# Altium schematic sheet Differential Encoder Receiver.SchDoc
size A4; SheetNumber: 5; SheetTotal: 6
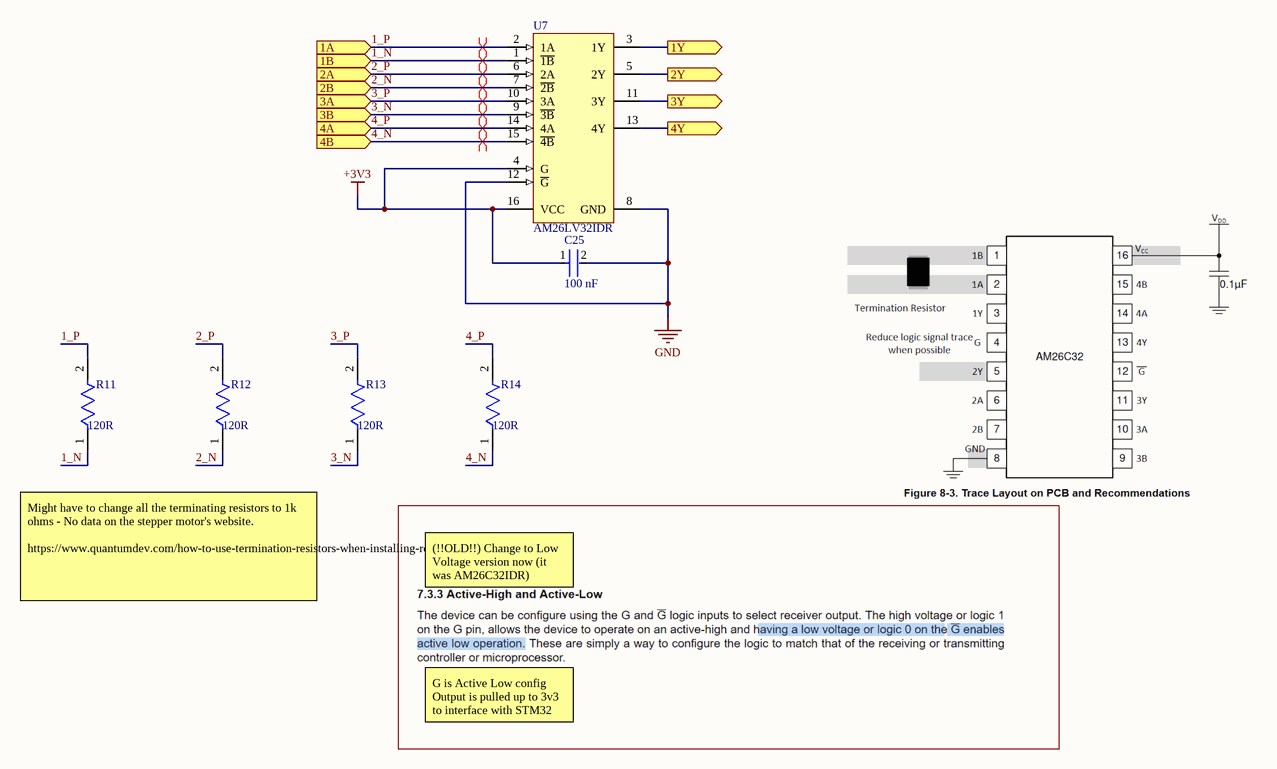
[diagram p0: Differential Encoder Receiver.SchDoc]

## Parts
C25  Capacitance: 100 nF  [FP-CC0603-DA-MFG]  (hidden comment: CC0603KRX7R9BB104)
R11  Resistance: 120R  [FP-CRCW0603-e3-MFG]  (hidden comment: 0603WAF1200T5E)
R12  Resistance: 120R  [FP-CRCW0603-e3-MFG]  (hidden comment: 0603WAF1200T5E)
R13  Resistance: 120R  [FP-CRCW0603-e3-MFG]  (hidden comment: 0603WAF1200T5E)
R14  Resistance: 120R  [FP-CRCW0603-e3-MFG]  (hidden comment: 0603WAF1200T5E)
U7  AM26LV32IDR  [D0016A_N]

## Ports
1A (in, see Actuation[2B]), 1B (in, see Actuation[2B]), 1Y (out, see Actuation[3B]), 2A (in, see Actuation[2B]), 2B (in, see Actuation[2B]), 2Y (out, see Actuation[3B]), 3A (in, see Actuation[2B]), 3B (in, see Actuation[2B]), 3Y (out, see Actuation[3B]), 4A (in, see Actuation[2B]), 4B (in, see Actuation[2B]), 4Y (out, see Actuation[3B])

## Nets
+3V3: C25.1 U7.4(G) U7.16(VCC)
GND: C25.2 U7.8(GND) U7.12(~{G})
1_N: R11.1 U7.1(~{1B}) ; port 1B
1_P: R11.2 U7.2(1A) ; port 1A
1Y: U7.3(1Y) ; port 1Y
2_N: R12.1 U7.7(~{2B}) ; port 2B
2_P: R12.2 U7.6(2A) ; port 2A
2Y: U7.5(2Y) ; port 2Y
3_N: R13.1 U7.9(~{3B}) ; port 3B
3_P: R13.2 U7.10(3A) ; port 3A
3Y: U7.11(3Y) ; port 3Y
4_N: R14.1 U7.15(~{4B}) ; port 4B
4_P: R14.2 U7.14(4A) ; port 4A
4Y: U7.13(4Y) ; port 4Y

## Layout directives
differential pair: 1_N, 1_P, 2_N, 2_P, 3_N, 3_P, 4_N, 4_P

## Notes on the sheet
- Might have to change all the terminating resistors to 1k ohms - No data on the stepper motor's website.
  https://www.quantumdev.com/how-to-use-termination-resistors-when-installing-rotary-incremental-encoders/
- (!!OLD!!) Change to Low Voltage version now (it was AM26C32IDR)
- G is Active Low config
  Output is pulled up to 3v3 to interface with STM32

## Library data of the parts
C25 = CMP-2100-03601-2: CAP CER 0.1UF 50V X7R 0603; Manufacturer: YAGEO; Material: Ceramic; Temperature Coefficient: 15%; Tolerance: 0.1; Value: 100 nF; Height: 0.9mm; Voltage: 50 V; ComponentLink2Description: Datasheet; Device Class L2: Capacitors; Temperature Range High: +125°C; Category: Cap; Footprint Url: http://www.yageo.com/exep/pages/download/literatures/UPY-C_GEN_24.pdf; ComponentLink2URL: http://www.yageo.com/documents/recent/UPY-GPHC_X7R_6.3V-to-50V_18.pdf; Package: CC0603-DA; Temperature: -55°C to +125°C; Voltage Rating: 50 V; Temperature Characteristic: X7R; Device Class L1: Passive Components; Temperature Range Low: -55°C; Manufacturer Part Number: CC0603KRX7R9BB104; RoHS: TRUE; Automotive: No; Device Class L3: Ceramic Capacitors; Octopart: https://octopart.com/cc0603krx7r9bb104-yageo-42244635; Mouser Description: Multilayer Ceramic Capacitor, CC Series, 0.1 - F, - 10%, X7R, 50 V, 0603 [1608 Metric]; Lead Free: Yes; Digikey Description: CAP CER 0.1UF 50V X7R 0603
R11-R14 = CMP-1666-00020-3: 100mW Thick Film Resistors 75V ±100ppm/℃ ±1% 120Ω 0603 Chip Resistor - Surface Mount ROHS; Temperature Coefficient: 100ppm/°C; RoHS Compliant: Yes; Lead Free: Lead Free; Termination: SMD/SMT; Radiation Hardening: No; Case Code (Imperial): 0603; Series: CRCW; Resistance Tolerance: 1%; Number of Terminations: 2; Tolerance: 1%; Max Operating Temperature: 155°C; Power Rating: 100mW; Contact Plating: Tin; Package Quantity: 10; Max Power Dissipation: 100mW; Case Code (Metric): 1608; Weight: 7.1E-05oz; Packaging: Tape and Reel; Working Voltage: 75V; Mount: Surface Mount; Military Standard: Not; Construction: Rectangular; Features: Automotive AEC-Q200; Depth: 0.85mm; Min Operating Temperature: -55°C; Case/Package: 0603; Height: 0.45mm; Voltage Rating (DC): 75V; Width: 0.033inch; Technology: THICK FILM; Length: 1.55mm; Voltage Rating: 75V; Resistor Type: Thick Film
U7 = CMP-0310-00279-2: Low-Voltage High-Speed Quadruple Differential Line Receiver, 3.3V, -40 to 85 degC, 16-Pin SOIC (D), Green (RoHS & no Sb/Br); Manufacturer: Texas Instruments; Supply Voltage(s)(V): 3.3; ESD(kV): 2; Receivers Per Package: 4; ICC(Max)(mA): 17; Rating: Catalog; SubFamily: RS-422; Eco-Plan: Green (RoHS & no Sb/Br); PackageDescription: 16-Pin Plastic Small Outline Integrated Circuit, 9.9 x 3.9 mm, Pitch 1.27 mm Pitch; Code_JEDEC: MS-012AC; PackageVersion: revM, Jun-2011; ComponentLink2Description: Package Specification; ComponentLink2URL: http://www.ti.com/litv/pdf/mpds178g; PartNumber: AM26LV32IDR; PackageReference: D0016A; ComponentLink1URL: http://www.ti.com/general/docs/lit/getliterature.tsp?genericPartNumber=AM26LV32&fileType=pdf; DatasheetVersion: SLLS202E; ComponentLink1Description: Datasheet; Footprint: AM26LS32; Mounting Technology: Surface Mount